# Altium schematic sheet GSM Power Source.SchDoc: GSM IoT Power Filter
size 393 x 292 mm; DocumentNumber: 8; SheetNumber: 24; SheetTotal: 40
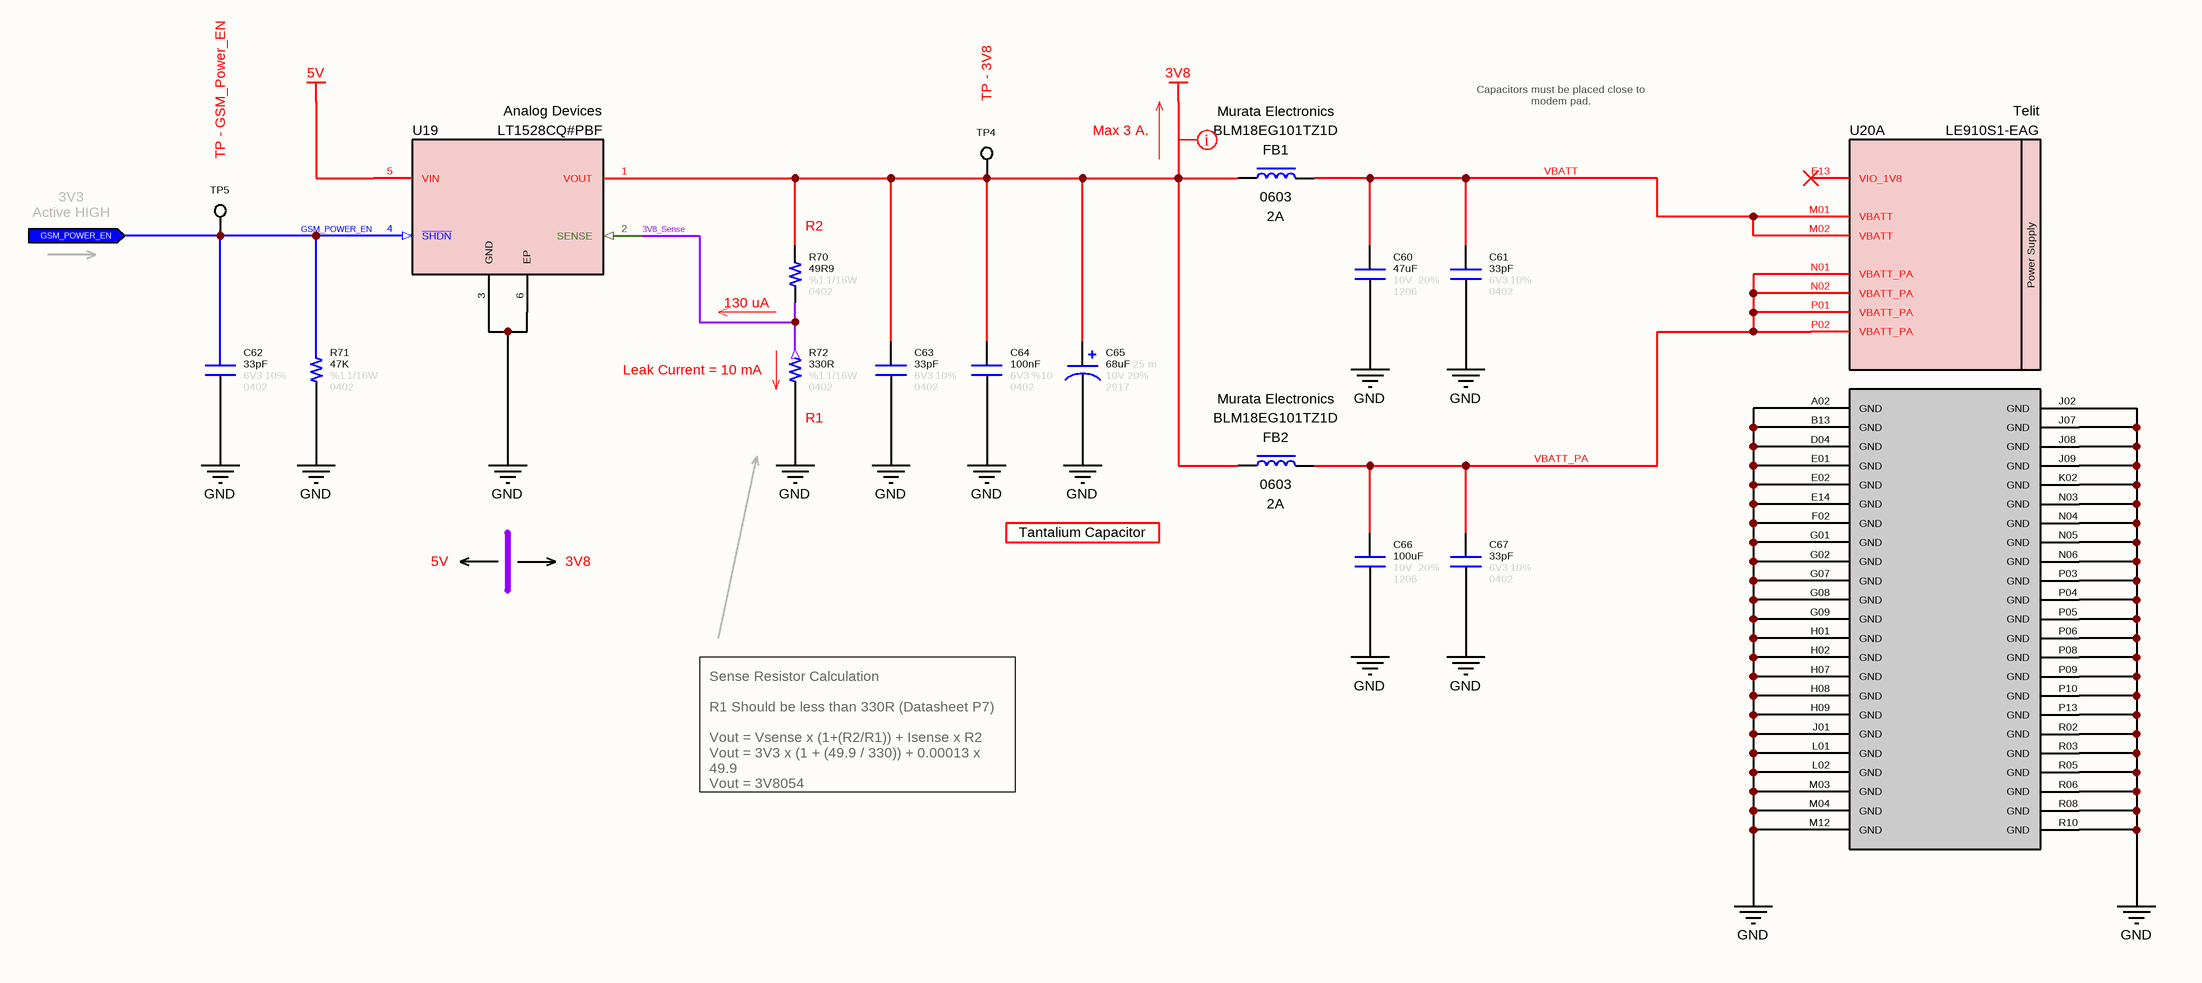
[diagram p0: GSM Power Source.SchDoc]

## Parts
C60  value 47uF  Tolerance: 20%  Case: 1206  Voltage: 10V  [CAPACITOR_1206]  (hidden comment: Capacitor - 47uF [1206] (Ceramic))
C61  value 33pF  Tolerance: 10%  Case: 0402  Voltage: 6V3  [CAPACITOR_0402]  (hidden comment: Capacitor - 33pF [0402] (Ceramic))
C62  value 33pF  Tolerance: 10%  Case: 0402  Voltage: 6V3  [CAPACITOR_0402]  (hidden comment: Capacitor - 33pF [0402] (Ceramic))
C63  value 33pF  Tolerance: 10%  Case: 0402  Voltage: 6V3  [CAPACITOR_0402]  (hidden comment: Capacitor - 33pF [0402] (Ceramic))
C64  value 100nF  Tolerance: %10  Voltage: 6V3  Case: 0402  [CAPACITOR_0402]  (hidden comment: Capacitor - 100nF [0402] (Ceramic))
C65  value 68uF  ESR: 25 m  Tolerance: 20%  Case: 2917  Voltage: 10V  [CAP_10TPE68M]  (hidden comment: Capacitor - 68uF [2917] (Tantalum))
C66  value 100uF  Tolerance: 20%  Case: 1206  Voltage: 10V  [CAPACITOR_1206]  (hidden comment: Capacitor - 100uF [1206] (Ceramic))
C67  value 33pF  Tolerance: 10%  Case: 0402  Voltage: 6V3  [CAPACITOR_0402]  (hidden comment: Capacitor - 33pF [0402] (Ceramic))
FB1  Maximum DC Current: 2A  Case: 0603  Manufacturer Part Number: BLM18EG101TZ1D  Manufacturer Name: Murata Electronics  [INDUCTOR_0603]  (hidden comment: Ferrite Bead)
FB2  Maximum DC Current: 2A  Case: 0603  Manufacturer Part Number: BLM18EG101TZ1D  Manufacturer Name: Murata Electronics  [INDUCTOR_0603]  (hidden comment: Ferrite Bead)
R70  value 49R9  Case: 0402  Tolerance: %1  Power: 1/16W  [RESISTOR_0402]  (hidden comment: 49R9 - 0402 - %1 - 1/16W)
R71  value 47K  Tolerance: %1  Case: 0402  Power: 1/16W  [RESISTOR_0402]  (hidden comment: 47K - 0402 - %1 - 1/16W)
R72  value 330R  Case: 0402  Tolerance: %1  Power: 1/16W  [RESISTOR_0402]  (hidden comment: 330R - 0402 - %1 - 1/16W)
TP4  TP - 3V8  [TP]  (no BOM)
TP5  TP - GSM_Power_EN  [TP]  (no BOM)
U19  Manufacturer Part Number: LT1528CQ#PBF  Manufacturer Name: Analog Devices  [DDPAK-5]  (hidden comment: LDO Regulator)
U20  Manufacturer Part Number: LE910S1-EAG  Manufacturer Name: Telit  [LE910 GSM Modem]  (hidden comment: LE910S1-EAG LTE GSM Module)  (part A of 19)

## Ports
GSM_POWER_EN (in)

## Nets
3V8: C63.2 C64.2 C65.1 FB1.1 FB2.1 R70.2 TP4.1 U19.1(VOUT)
5V: U19.5(VIN)
GND: C60.1 C61.1 C62.1 C63.1 C64.1 C65.2 C66.1 C67.1 R71.1 R72.1 U19.3(GND) U19.6(EP) U20.A02(GND) U20.B13(GND) U20.D04(GND) U20.E01(GND) U20.E02(GND) U20.E14(GND) U20.F02(GND) U20.G01(GND) U20.G02(GND) U20.G07(GND) U20.G08(GND) U20.G09(GND) U20.H01(GND) U20.H02(GND) U20.H07(GND) U20.H08(GND) U20.H09(GND) U20.J01(GND) U20.J02(GND) U20.J07(GND) U20.J08(GND) U20.J09(GND) U20.K02(GND) U20.L01(GND) U20.L02(GND) U20.M03(GND) U20.M04(GND) U20.M12(GND) U20.N03(GND) U20.N04(GND) U20.N05(GND) U20.N06(GND) U20.P03(GND) U20.P04(GND) U20.P05(GND) U20.P06(GND) U20.P08(GND) U20.P09(GND) U20.P10(GND) U20.P13(GND) U20.R02(GND) U20.R03(GND) U20.R05(GND) U20.R06(GND) U20.R08(GND) U20.R10(GND)
3V8_Sense: R70.1 R72.2 U19.2(SENSE)
GSM_POWER_EN: C62.2 R71.2 TP5.1 U19.4(~{SHDN}) ; port GSM_POWER_EN
VBATT: C60.2 C61.2 FB1.2 U20.M01(VBATT) U20.M02(VBATT)
VBATT_PA: C66.2 C67.2 FB2.2 U20.N01(VBATT_PA) U20.N02(VBATT_PA) U20.P01(VBATT_PA) U20.P02(VBATT_PA)

Not connected (* = marked no-connect by the designer): U20 E13(VIO_1V8)*

## Layout directives
rule Supply Nets [Voltage = 3.800]: 3V8

## Notes on the sheet
- Max 3 A.
- Capacitors must be placed close to modem pad.
- 3V3
  Active HIGH
- (near R70) 130 uA
- (near R70) R2
- (near R72) Leak Current = 10 mA
- (near R72) R1
- 5V
- 3V8
- Tantalium Capacitor
- Sense Resistor Calculation
  R1 Should be less than 330R (Datasheet P7)
  Vout = Vsense x (1+(R2/R1)) + Isense x R2
  Vout = 3V3 x (1 + (49.9 / 330)) + 0.00013 x 49.9
  Vout = 3V8054
- © 2022 All rights reserved.
  This document may not, in whole or in part, be copied, photocopied, reproduced, translated or converted to any electronic or machine readable from without prior written permission of Mehmet Günce Akkoyun.
  Engineer contact : akkoyun@me.com
- Property of
- Engineer :
- Date :
- Size :
- A3
- Time :
- Project :
- Page :
- /
- Customer :
- Product ID :
- Module ID :
- Version :
- File :
- Revision :
- (in symbol IC - LE910S1-EAG, part A) Power Supply

## Library data of the parts
C60 = Capacitor - 47uF [1206-10V]: Multilayer Ceramic Capacitors MLCC - SMD/SMT 47UF 10V 20% 1206; Manufacturer Part Number: C1206C476M8PAC; Manufacturer Name: Kemet
C61-C63 C67 = Capacitor - 33pF [0402-6V3]: Manufacturer Name: Kemet; Manufacturer Part Number: C0402C330J9RACAUTO; ComponentLink1Description: DataSheet; ComponentLink1URL: https://api.kemet.com/component-edge/download/datasheet/C0402C330J9RACAUTO.pdf; ComponentLink2Description: Mouser; ComponentLink2URL: https://www.mouser.com/Search/Refine.aspx?Keyword=80-C0402C330J9RAUTO
C64 = Capacitor - 100nF [0402-6V3]: Capacitor - 100nF [0402-6V3] (Ceramic); Manufacturer Name: AVX; Manufacturer Part Number: 04026D104KAT4A; ComponentLink1Description: Mouser; ComponentLink1URL: https://www.mouser.com.tr/ProductDetail/AVX/04026D104KAT4A?qs=sGAEpiMZZMs0AnBnWHyRQPg4iYkCw7IMED%2F4kpqgf7w%3D; ComponentLink2Description: DataSheet; ComponentLink2URL: https://www.mouser.com.tr/datasheet/2/40/cx5r-776519.pdf
C65 = Capacitor - 68uF [2917-10V] (Tantalium): Tantalum Capacitors - Polymer 10V 68uF 2917 20% ESR=25mOhms; Manufacturer Name: Panasonic; Manufacturer Part Number: 10TPE68M
C66 = Capacitor - 100uF [1206-10V]: Multilayer Ceramic Capacitors MLCC - SMD/SMT 100UF 10V 20% 1206; Manufacturer Part Number: GRM31CR61A107MEA8L; Manufacturer Name: Murata
FB1 FB2 = Inductor - Ferrite Bead [SMD]: Ferrite Beads 0603 100ohms 2000mA Auto Infotainment; Maximum DC Resistance: 45 mOhms; Tolerance: 25%; Value: BLM18EG101TZ1D; Height: 0.75mm; Maximum Operating Temperature: + 125; Minimum Operating Temperature: -55
R70 = Resistor - 49R9 [0402]: Thick Film Resistors - SMD 1/16 W 49.9 Ohm 1%; Manufacturer Name: Vishay; Manufacturer Part Number: CRCW040249R9FKED; ComponentLink1Description: DataSheet; ComponentLink1URL: https://www.mouser.com.tr/datasheet/2/427/dcrcwe3-1762152.pdf; ComponentLink2Description: Mouser; ComponentLink2URL: https://www.mouser.com.tr/ProductDetail/Vishay-Dale/CRCW0402330RFKED?qs=sGAEpiMZZMu61qfTUdNhG2DpbjADlD3GGS6SwBlLi5Q%3D
R71 = Resistor - 47K [0402]: Thick Film Resistors - SMD 1/16 W 47 KOhm 1%; Manufacturer Name: Vishay; Manufacturer Part Number: CRCW040247K0FKED; ComponentLink1Description: DataSheet; ComponentLink1URL: https://www.mouser.com.tr/datasheet/2/427/dcrcwe3-1762152.pdf; ComponentLink2Description: Mouser; ComponentLink2URL: https://www.mouser.com.tr/ProductDetail/Vishay-Dale/CRCW040247K0FKED?qs=sGAEpiMZZMu61qfTUdNhG2DpbjADlD3GL%252B3h1elTxqU%3D
R72 = Resistor - 330R [0402]: Thick Film Resistors - SMD 1/16 W 330 Ohm 1%; Manufacturer Name: Vishay; Manufacturer Part Number: CRCW0402330RFKED; ComponentLink1Description: DataSheet; ComponentLink1URL: https://www.mouser.com.tr/datasheet/2/427/dcrcwe3-1762152.pdf; ComponentLink2Description: Mouser; ComponentLink2URL: https://www.mouser.com.tr/ProductDetail/Vishay-Dale/CRCW0402330RFKED?qs=sGAEpiMZZMu61qfTUdNhG2DpbjADlD3GGS6SwBlLi5Q%3D
TP4 TP5 = PCB - Test Point: Test Point
U19 = IC - LT1528CQ: LDO Voltage Regulators 3A L Drop Reg for uP Applications; Height: 1.45mm; Case: DDPAK-5
U20 = IC - LE910S1-EAG: Telit LE910S1-EAG GPRS/GNSS Module; Case: BGA